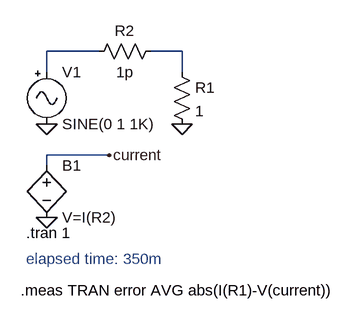
[diagram p0: schematic Isense1.asc]
Isense1.asc, the LTspice schematic file:
Version 4
SHEET 1 880 680
WIRE 128 112 48 112
WIRE 256 112 208 112
WIRE 48 144 48 112
WIRE 256 144 256 112
WIRE 144 272 48 272
WIRE 48 288 48 272
FLAG 48 368 0
FLAG 144 272 current
FLAG 48 224 0
FLAG 256 224 0
SYMBOL bv 48 272 R0
SYMATTR InstName B1
SYMATTR Value V=I(R2)
SYMBOL Misc\\signal 48 128 R0
WINDOW 123 0 0 Left 0
WINDOW 39 0 0 Left 0
SYMATTR InstName V1
SYMBOL res 240 128 R0
SYMATTR InstName R1
SYMATTR Value 1
SYMBOL res 112 128 R270
WINDOW 0 32 56 VTop 2
WINDOW 3 0 56 VBottom 2
SYMATTR InstName R2
SYMATTR Value 1p
TEXT 16 392 Left 2 !.tran 1
TEXT 16 432 Left 2 ;elapsed time: 350m
TEXT 8 480 Left 2 !.meas TRAN error AVG abs(I(R1)-V(current))

The netlist it stands for:
* Isense1.asc
B1 current 0 V=I(R2)
V1 N001 0 SINE(0 1 1K)
R1 N002 0 1
R2 N001 N002 1p
.tran 1
* elapsed time: 350m
.meas TRAN error AVG abs(I(R1)-V(current))
.backanno
.end